# Altium project PCB_Project_BO6.PrjPcb
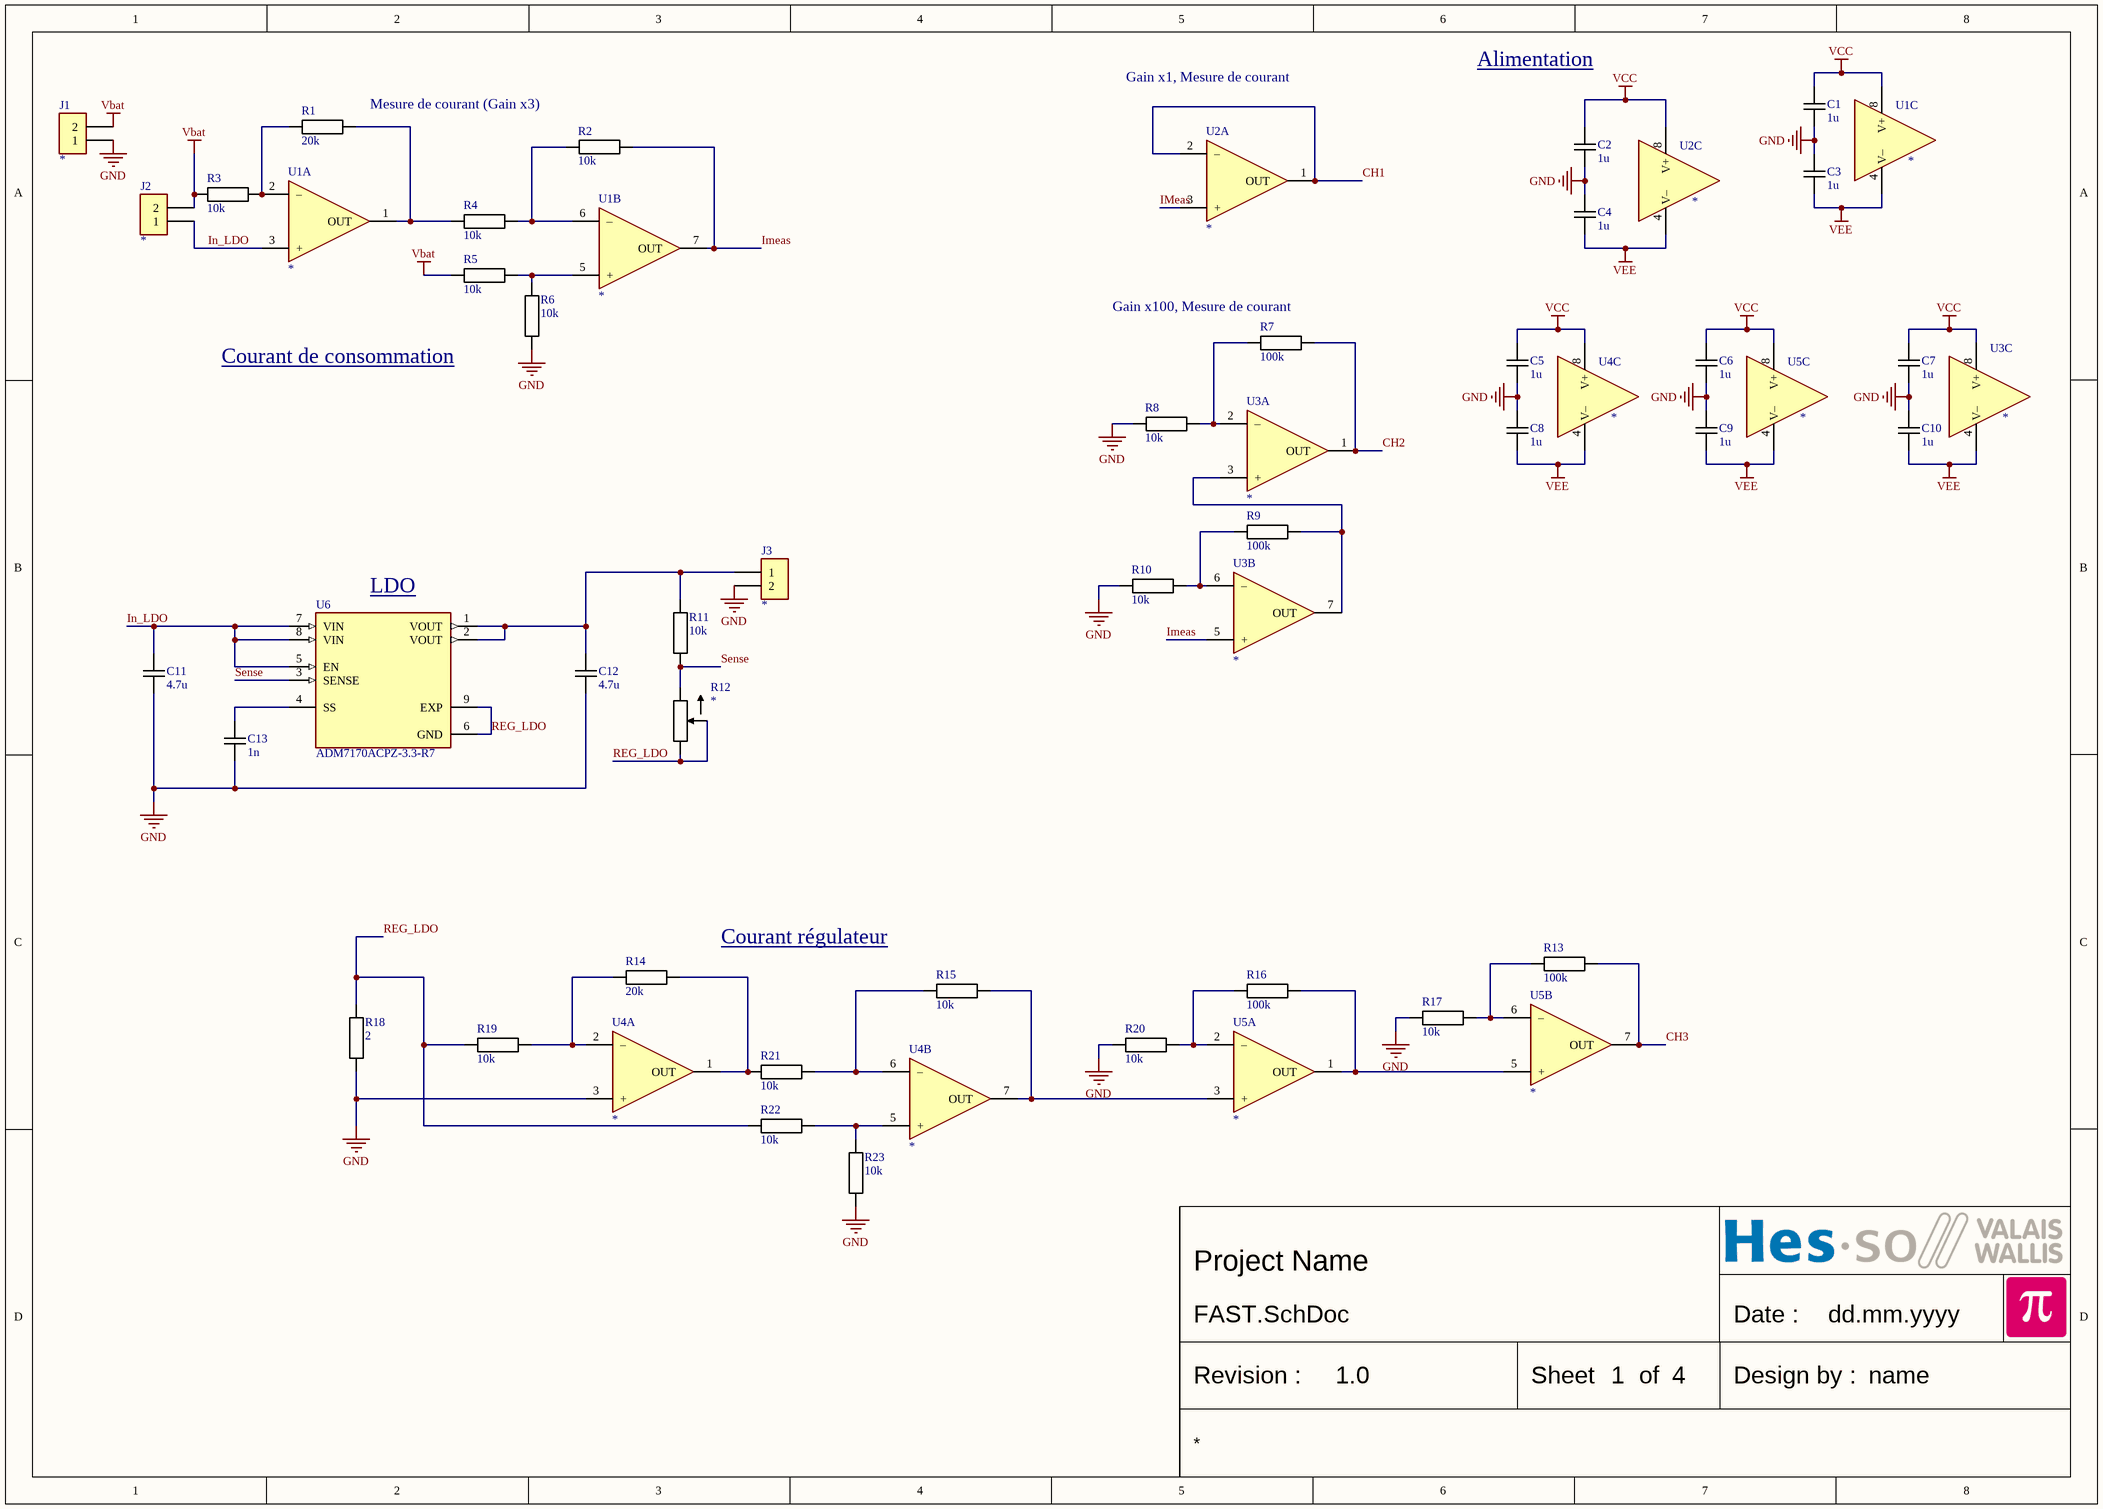
[diagram p0: FAST.SchDoc]
PcbDate: dd.mm.yyyy; PcbDesigner: name; PcbRevision: 1.0; SchematicDate: dd.mm.yyyy; SchematicDesigner: name; SchematicRevision: 1.0
4 sheets, 159 parts. Net scope: global (net labels, ports and power ports of the same name join across sheets).
Board file: Eurocircuits4L.PcbDoc
Sheets:
  FAST.SchDoc
  PROC.SchDoc
  SLOW.SchDoc
  Batterie.SchDoc

## Sheet FAST.SchDoc
size A3; CompanyName: HESSO; Address1: Route du Rawyl 47; Address2: 1950 Sion; Address3: Switzerland; SheetNumber: 1; SheetTotal: 4; PageSetup: Record=PageOptions|CenterHorizontal=True|CenterVertical=True|PrintScale=1.00|XCorrection=1.00|YCorrection=1.00|PrintKind=1|BorderSize=5000000|LeftOffset=0|BottomOffset=0|Orientation=2|PaperLength=1000|PaperWidth=1000|Scale=100|PaperSource=15|PrintQuality=1200|MediaType=1|DitherType=10|PrintScaleMode=1|PaperKind=A4|PaperIndex=9; ProjectName: Project Name

### Parts
C1  1u  [CAPACITOR 1005 REFLOW]
C2  1u  [CAPACITOR 1005 REFLOW]
C3  1u  [CAPACITOR 1005 REFLOW]
C4  1u  [CAPACITOR 1005 REFLOW]
C5  1u  [CAPACITOR 1005 REFLOW]
C6  1u  [CAPACITOR 1005 REFLOW]
C7  1u  [CAPACITOR 1005 REFLOW]
C8  1u  [CAPACITOR 1005 REFLOW]
C9  1u  [CAPACITOR 1005 REFLOW]
C10  1u  [CAPACITOR 1005 REFLOW]
C11  4.7u  [CAPACITOR 1005 REFLOW]
C12  4.7u  [CAPACITOR 1005 REFLOW]
C13  1n  [CAPACITOR 1005 REFLOW]
J1  *  [WE 691312510002]
J2  *  [WE 691312510002]
J3  *  [WE 691312510002]
R1  20k  [RESISTOR 1005 REFLOW]
R2  10k  [RESISTOR 1005 REFLOW]
R3  10k  [RESISTOR 1005 REFLOW]
R4  10k  [RESISTOR 1005 REFLOW]
R5  10k  [RESISTOR 1005 REFLOW]
R6  10k  [RESISTOR 1005 REFLOW]
R7  100k  [RESISTOR 1005 REFLOW]
R8  10k  [RESISTOR 1005 REFLOW]
R9  100k  [RESISTOR 1005 REFLOW]
R10  10k  [RESISTOR 1005 REFLOW]
R11  10k  [RESISTOR 1005 REFLOW]
R12  *  [Trimmer PIHER PT15]
R13  100k  [RESISTOR 1005 REFLOW]
R14  20k  [RESISTOR 1005 REFLOW]
R15  10k  [RESISTOR 1005 REFLOW]
R16  100k  [RESISTOR 1005 REFLOW]
R17  10k  [RESISTOR 1005 REFLOW]
R18  2  [RESISTOR 1005 REFLOW]
R19  10k  [RESISTOR 1005 REFLOW]
R20  10k  [RESISTOR 1005 REFLOW]
R21  10k  [RESISTOR 1005 REFLOW]
R22  10k  [RESISTOR 1005 REFLOW]
R23  10k  [RESISTOR 1005 REFLOW]
U1  *  [SO8 P1.27 C4.0X5.0 H1.75]  (parts A,B,C of 3)
U2  *  [SO8 P1.27 C4.0X5.0 H1.75]  (parts A,C of 3)
U3  *  [SO8 P1.27 C4.0X5.0 H1.75]  (parts A,B,C of 3)
U4  *  [SO8 P1.27 C4.0X5.0 H1.75]  (parts A,B,C of 3)
U5  *  [SO8 P1.27 C4.0X5.0 H1.75]  (parts A,B,C of 3)
U6  ADM7170ACPZ-3.3-R7  [LFCSP8 P0.5 C3.0x2.8 H1.0]

### Nets
GND: C1.2 C2.2 C3.1 C4.1 C5.2 C6.2 C7.2 C8.1 C9.1 C10.1 C11.2 C12.2 C13.2 J1.1 J3.2 R6.1 R8.1 R10.1 R17.2 R18.1 R20.2 R23.2 U4.3(+)
Vbat: J1.2 J2.2 R3.1 R5.1
VCC: C1.1 C2.1 C5.1 C6.1 C7.1 U1.8(V+) U2.8(V+) U3.8(V+) U4.8(V+) U5.8(V+)
VEE: C3.2 C4.2 C8.2 C9.2 C10.2 U1.4(V–) U2.4(V–) U3.4(V–) U4.4(V–) U5.4(V–)
CH1: U2.1(OUT) U2.2(–)
CH2: R7.2 U3.1(OUT)
CH3: R13.1 U5.7(OUT)
IMeas: R2.2 U1.7(OUT) U2.3(+) U3.5(+)
In_LDO: C11.1 J2.1 U1.3(+) U6.5(EN) U6.7(VIN) U6.8(VIN)
REG_LDO: R12.1 R12.2(WIPER) R18.2 R19.2 R22.2 U6.6(GND) U6.9(EXP)
Sense: R11.1 R12.3 U6.3(SENSE)
NetC12_1: C12.1 J3.1 R11.2 U6.1(VOUT) U6.2(VOUT)
NetC13_1: C13.1 U6.4(SS)
NetR1_1: R1.1 R3.2 U1.2(–)
NetR1_2: R1.2 R4.1 U1.1(OUT)
NetR2_1: R2.1 R4.2 U1.6(–)
NetR5_2: R5.2 R6.2 U1.5(+)
NetR7_1: R7.1 R8.2 U3.2(–)
NetR9_1: R9.1 R10.2 U3.6(–)
NetR9_2: R9.2 U3.3(+) U3.7(OUT)
NetR13_2: R13.2 R17.1 U5.6(–)
NetR14_1: R14.1 R21.2 U4.1(OUT)
NetR14_2: R14.2 R19.1 U4.2(–)
NetR15_1: R15.1 U4.7(OUT) U5.3(+)
NetR15_2: R15.2 R21.1 U4.6(–)
NetR16_1: R16.1 U5.1(OUT) U5.5(+)
NetR16_2: R16.2 R20.1 U5.2(–)
NetR22_1: R22.1 R23.1 U4.5(+)

### Notes on the sheet
- Mesure de courant (Gain x3)
- Gain x1, Mesure de courant
- Alimentation
- (near R7) Gain x100, Mesure de courant
- Courant de consommation
- (near U6) LDO
- Courant régulateur
- Date :
- Revision :
- Sheet
- of
- Design by :

### Library data of the parts
C1-C13 = Capacitor
  C1-C10: Value: 1u
  C11 C12: Value: 4.7u
  C13: Value: 1n
J1-J3 = Header2: PCB terminal block; Value: *
R1-R11 R13-R23 = Resistor
  R1 R14: Value: 20k
  R2-R6 R8 R10 R11 R15 R17 R19-R23: Value: 10k
  R7 R9 R13 R16: Value: 100k
  R18: Value: 2
R12 = Trimmer: Value: *
U1-U5 = OPA DUAL: Generic dual OPA 8 pins; Value: *
U6 = ADM7170ACPZ-3.3-R7: 6.5 V, 500 mA, Ultralow Noise, High PSRR, Fast Transient Response CMOS LDO; MF: Analog Devices; SnapEDA_Link: https://www.snapeda.com/parts/ADM7170ACPZ-3.3-R7/Analog+Devices/view-part/?ref=snap; Package: LFCSP -8 Analog Devices; Value: *; MP: ADM7170ACPZ-3.3-R7; Check_prices: https://www.snapeda.com/parts/ADM7170ACPZ-3.3-R7/Analog+Devices/view-part/?ref=eda

## Sheet PROC.SchDoc
size A3; CompanyName: HESSO; Address1: Route du Rawyl 47; Address2: 1950 Sion; Address3: Switzerland; SheetNumber: 2; SheetTotal: 4; PageSetup: Record=PageOptions|CenterHorizontal=True|CenterVertical=True|PrintScale=1.00|XCorrection=1.00|YCorrection=1.00|PrintKind=1|BorderSize=5000000|LeftOffset=0|BottomOffset=0|Orientation=2|PaperLength=1000|PaperWidth=1000|Scale=100|PaperSource=15|PrintQuality=1200|MediaType=1|DitherType=10|PrintScaleMode=1|PaperKind=A4|PaperIndex=9; ProjectName: Project Name
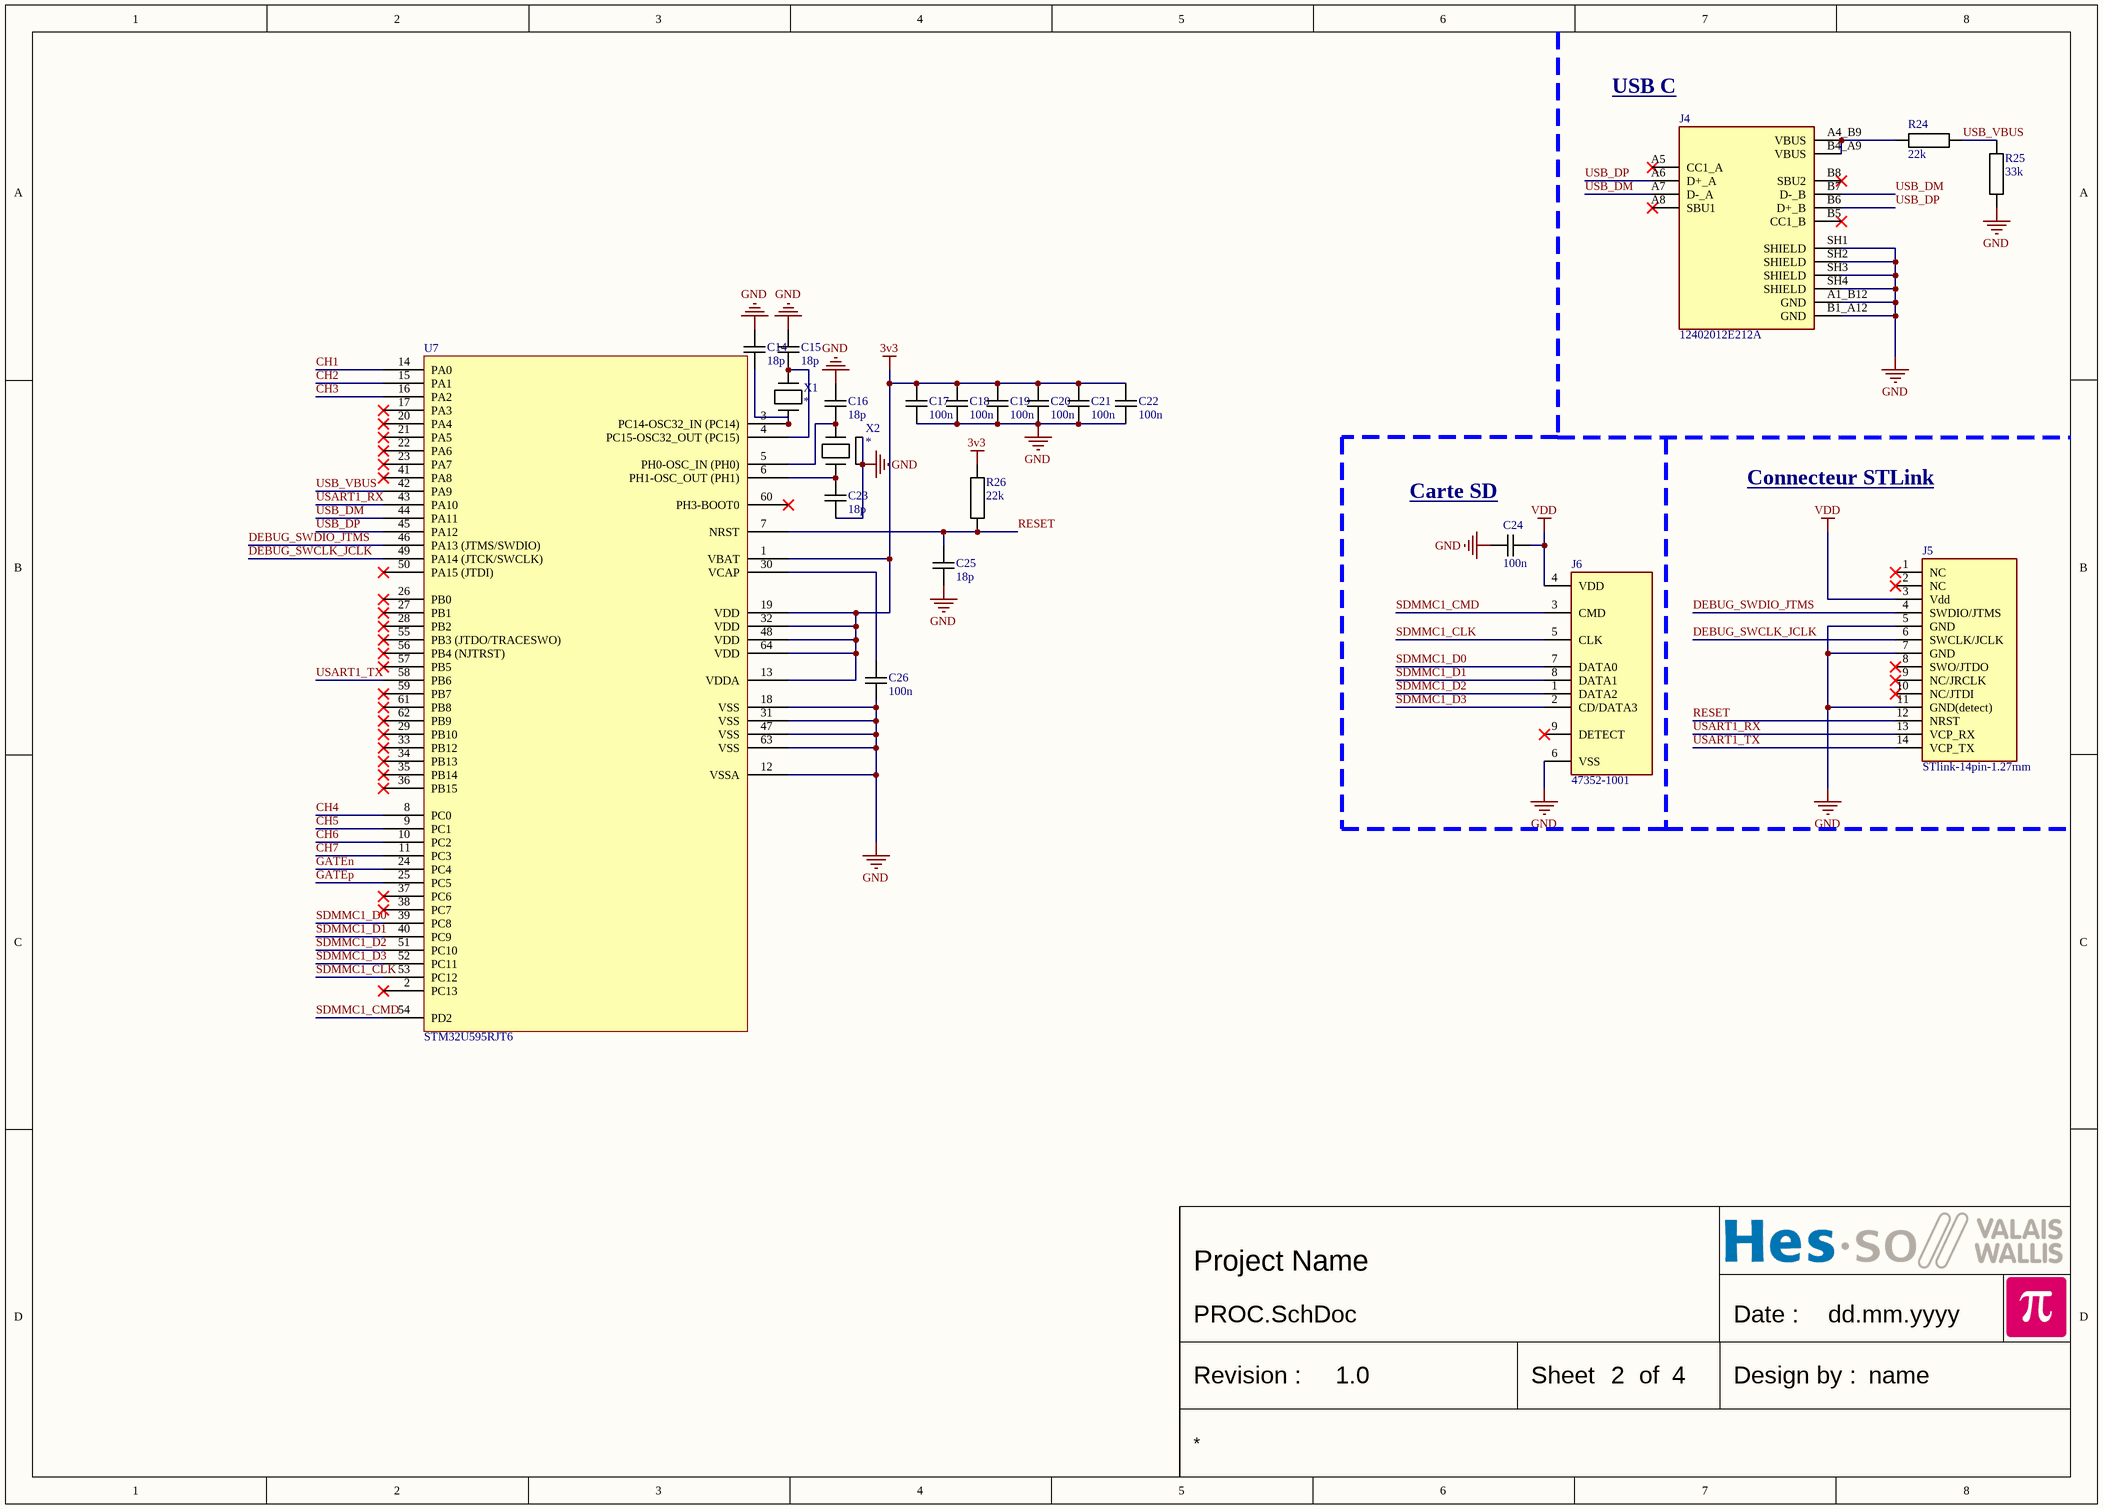
[diagram p1: PROC.SchDoc]

### Parts
C14  18p  [CAPACITOR 1005 REFLOW]
C15  18p  [CAPACITOR 1005 REFLOW]
C16  18p  [CAPACITOR 1005 REFLOW]
C17  100n  [CAPACITOR 1005 REFLOW]
C18  100n  [CAPACITOR 1005 REFLOW]
C19  100n  [CAPACITOR 1005 REFLOW]
C20  100n  [CAPACITOR 1005 REFLOW]
C21  100n  [CAPACITOR 1005 REFLOW]
C22  100n  [CAPACITOR 1005 REFLOW]
C23  18p  [CAPACITOR 1005 REFLOW]
C24  100n  [CAPACITOR 1005 REFLOW]
C25  18p  [CAPACITOR 1005 REFLOW]
C26  100n  [CAPACITOR 1005 REFLOW]
J4  12402012E212A  [USB-C-SMD Amphenol 12402012E212A]
J5  STlink-14pin-1.27mm  [FTSH-107-01-S-D-K]
J6  47352-1001  [SD MICRO MOLEX 47352-1001]
R24  22k  [RESISTOR 1005 REFLOW]
R25  33k  [RESISTOR 1005 REFLOW]
R26  22k  [RESISTOR 1005 REFLOW]
U7  STM32U595RJT6  [TSQFP50P1200X1200X160-64N]
X1  *  [Crystal C3.2x1.5 Abracon ABS07]
X2  *  [Crystal C2.0x1.6 Kyocera CX2016DB]

### Nets
3v3: C17.1 C18.1 C19.1 C20.1 C21.1 C22.1 R26.2 U7.1(VBAT) U7.13(VDDA) U7.19(VDD) U7.32(VDD) U7.48(VDD) U7.64(VDD)
GND: C14.1 C15.1 C16.1 C17.2 C18.2 C19.2 C20.2 C21.2 C22.2 C23.2 C24.2 C25.2 C26.2 J4.A1_B12(GND) J4.B1_A12(GND) J4.SH1(SHIELD) J4.SH2(SHIELD) J4.SH3(SHIELD) J4.SH4(SHIELD) J5.5(GND) J5.7(GND) J5.11(GND(detect)) J6.6(VSS) R25.1 U7.12(VSSA) U7.18(VSS) U7.31(VSS) U7.47(VSS) U7.63(VSS) X2.2 X2.4
VDD: C24.1 J5.3(Vdd) J6.4(VDD)
CH1: U7.14(PA0)
CH2: U7.15(PA1)
CH3: U7.16(PA2)
CH4: U7.8(PC0)
CH5: U7.9(PC1)
CH6: U7.10(PC2)
CH7: U7.11(PC3)
DEBUG_SWCLK_JCLK: J5.6(SWCLK/JCLK) U7.49(PA14_(JTCK/SWCLK))
DEBUG_SWDIO_JTMS: J5.4(SWDIO/JTMS) U7.46(PA13_(JTMS/SWDIO))
GATEn: U7.24(PC4)
GATEp: U7.25(PC5)
RESET: C25.1 J5.12(NRST) R26.1 U7.7(NRST)
SDMMC1_CLK: J6.5(CLK) U7.53(PC12)
SDMMC1_CMD: J6.3(CMD) U7.54(PD2)
SDMMC1_D0: J6.7(DATA0) U7.39(PC8)
SDMMC1_D1: J6.8(DATA1) U7.40(PC9)
SDMMC1_D2: J6.1(DATA2) U7.51(PC10)
SDMMC1_D3: J6.2(CD/DATA3) U7.52(PC11)
USART1_RX: J5.13(VCP_RX) U7.43(PA10)
USART1_TX: J5.14(VCP_TX) U7.58(PB6)
USB_DM: J4.A7(D-_A) J4.B7(D-_B) U7.44(PA11)
USB_DP: J4.A6(D+_A) J4.B6(D+_B) U7.45(PA12)
USB_VBUS: R24.2 R25.2 U7.42(PA9)
NetC14_2: C14.2 U7.3(PC14-OSC32_IN_(PC14)) X1.1
NetC15_2: C15.2 U7.4(PC15-OSC32_OUT_(PC15)) X1.2
NetC16_2: C16.2 U7.5(PH0-OSC_IN_(PH0)) X2.3
NetC23_1: C23.1 U7.6(PH1-OSC_OUT_(PH1)) X2.1
NetC26_1: C26.1 U7.30(VCAP)
NetJ4_A4_B9: J4.A4_B9(VBUS) J4.B4_A9(VBUS) R24.1

Not connected (* = marked no-connect by the designer): J4 A5(CC1_A)* A8(SBU1)* B5(CC1_B)* B8(SBU2)*; J5 1(NC)* 2(NC)* 8(SWO/JTDO)* 9(NC/JRCLK)* 10(NC/JTDI)*; J6 9(DETECT)*; U7 2(PC13)* 17(PA3)* 20(PA4)* 21(PA5)* 22(PA6)* 23(PA7)* 26(PB0)* 27(PB1)* 28(PB2)* 29(PB10)* 33(PB12)* 34(PB13)* 35(PB14)* 36(PB15)* 37(PC6)* 38(PC7)* 41(PA8)* 50(PA15_(JTDI))* 55(PB3_(JTDO/TRACESWO))* 56(PB4_(NJTRST))* 57(PB5)* 59(PB7)* 60(PH3-BOOT0)* 61(PB8)* 62(PB9)*

### Notes on the sheet
- (near J4) USB C
- (near C24) Carte SD
- Connecteur STLink
- Date :
- Revision :
- Sheet
- of
- Design by :

### Library data of the parts
C14-C26 = Capacitor
  C14-C16 C23 C25: Value: 18p
  C17-C22 C24 C26: Value: 100n
J4 = USB-C-SMD Amphenol 12402012E212A: Value: 12402012E212A
J6 = SD-MICRO MOLEX 47352-1001: SD Card  Micro; Value: 47352-1001
R24-R26 = Resistor
  R24 R26: Value: 22k
  R25: Value: 33k
X1 = Crystal C3.2x1.5 Abracon ABS07: Value: *
X2 = Crystal C2.0x1.6 Kyocera CX2016DB: Value: *
J5 = STlink-14pin-1.27mm: Value: STlink-14pin-1.27mm

## Sheet SLOW.SchDoc
size A3; CompanyName: HESSO; Address1: Route du Rawyl 47; Address2: 1950 Sion; Address3: Switzerland; SheetNumber: 3; SheetTotal: 4; PageSetup: Record=PageOptions|CenterHorizontal=True|CenterVertical=True|PrintScale=1.00|XCorrection=1.00|YCorrection=1.00|PrintKind=1|BorderSize=5000000|LeftOffset=0|BottomOffset=0|Orientation=2|PaperLength=1000|PaperWidth=1000|Scale=100|PaperSource=15|PrintQuality=1200|MediaType=1|DitherType=10|PrintScaleMode=1|PaperKind=A4|PaperIndex=9; ProjectName: Project Name
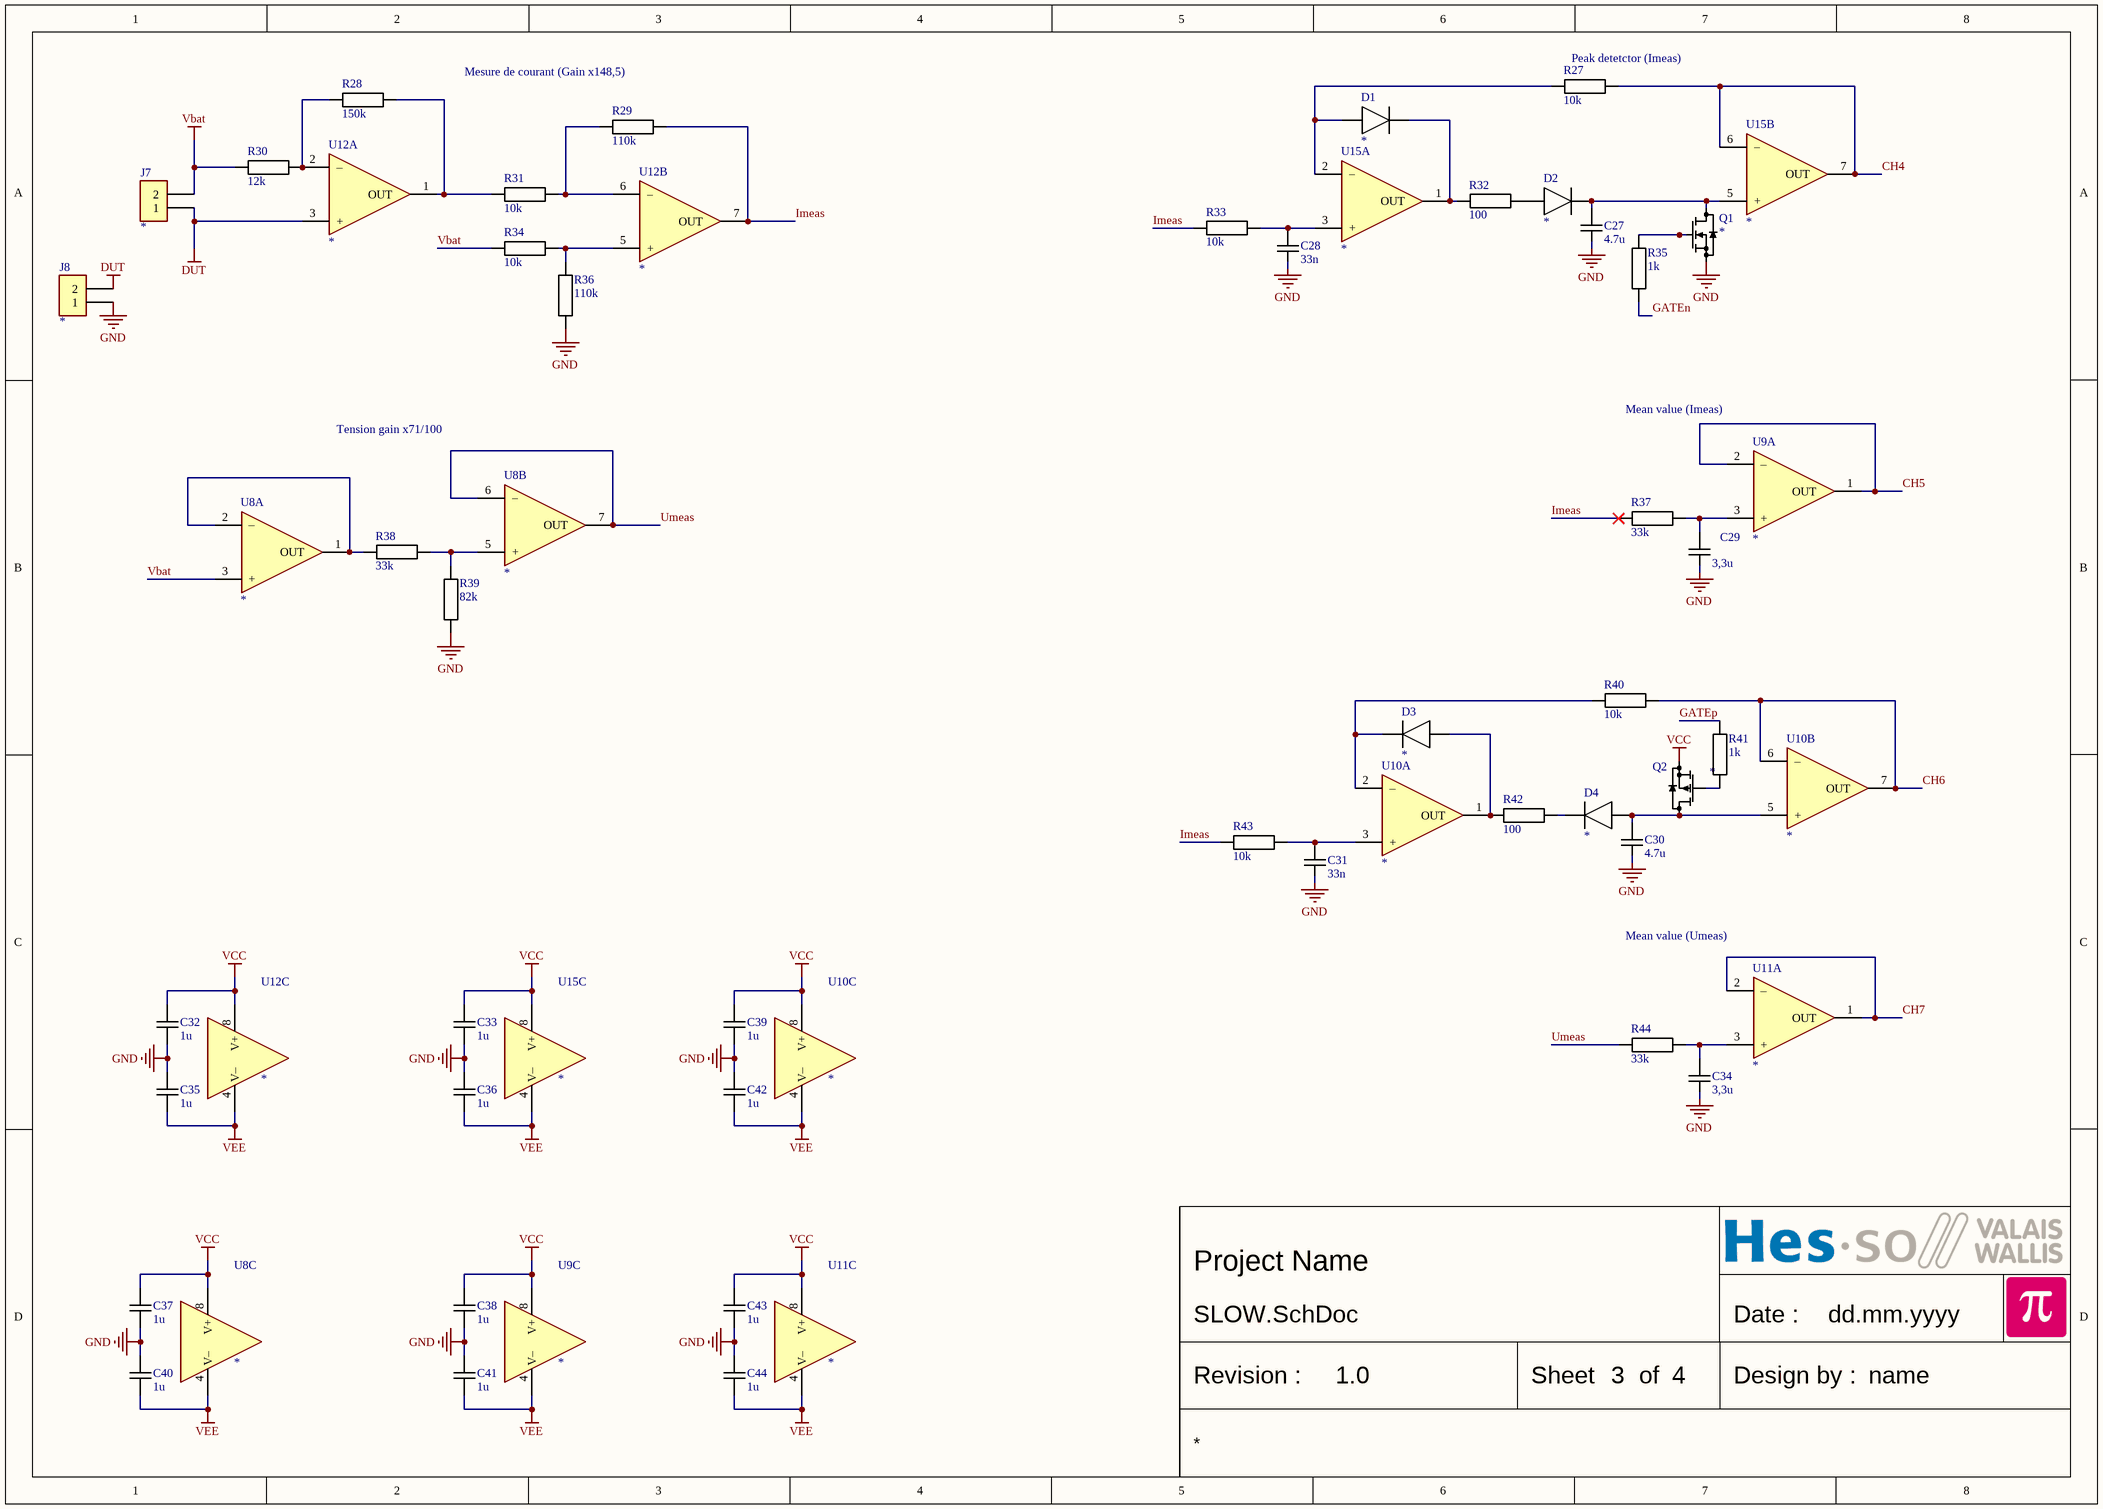
[diagram p2: SLOW.SchDoc]

### Parts
C27  4.7u  [CAPACITOR 1005 REFLOW]
C28  33n  [CAPACITOR 1005 REFLOW]
C29  3,3u  [CAPACITOR 1005 REFLOW]
C30  4.7u  [CAPACITOR 1005 REFLOW]
C31  33n  [CAPACITOR 1005 REFLOW]
C32  1u  [CAPACITOR 1005 REFLOW]
C33  1u  [CAPACITOR 1005 REFLOW]
C34  3,3u  [CAPACITOR 1005 REFLOW]
C35  1u  [CAPACITOR 1005 REFLOW]
C36  1u  [CAPACITOR 1005 REFLOW]
C37  1u  [CAPACITOR 1005 REFLOW]
C38  1u  [CAPACITOR 1005 REFLOW]
C39  1u  [CAPACITOR 1005 REFLOW]
C40  1u  [CAPACITOR 1005 REFLOW]
C41  1u  [CAPACITOR 1005 REFLOW]
C42  1u  [CAPACITOR 1005 REFLOW]
C43  1u  [CAPACITOR 1005 REFLOW]
C44  1u  [CAPACITOR 1005 REFLOW]
D1  *  [DIODE SOD323 REFLOW]
D2  *  [DIODE SOD323 REFLOW]
D3  *  [DIODE SOD323 REFLOW]
D4  *  [DIODE SOD323 REFLOW]
J7  *  [WE 691312510002]
J8  *  [WE 691312510002]
Q1  *  [SOT23 P0.95 C1.6x3.0 H1.3]
Q2  *  [SOT23 P0.95 C1.6x3.0 H1.3]
R27  10k  [RESISTOR 1005 REFLOW]
R28  150k  [RESISTOR 1005 REFLOW]
R29  110k  [RESISTOR 1005 REFLOW]
R30  12k  [RESISTOR 1005 REFLOW]
R31  10k  [RESISTOR 1005 REFLOW]
R32  100  [RESISTOR 1005 REFLOW]
R33  10k  [RESISTOR 1005 REFLOW]
R34  10k  [RESISTOR 1005 REFLOW]
R35  1k  [RESISTOR 1005 REFLOW]
R36  110k  [RESISTOR 1005 REFLOW]
R37  33k  [RESISTOR 1005 REFLOW]
R38  33k  [RESISTOR 1005 REFLOW]
R39  82k  [RESISTOR 1005 REFLOW]
R40  10k  [RESISTOR 1005 REFLOW]
R41  1k  [RESISTOR 1005 REFLOW]
R42  100  [RESISTOR 1005 REFLOW]
R43  10k  [RESISTOR 1005 REFLOW]
R44  33k  [RESISTOR 1005 REFLOW]
U8  *  [SO8 P1.27 C4.0X5.0 H1.75]  (parts A,B,C of 3)
U9  *  [SO8 P1.27 C4.0X5.0 H1.75]  (parts A,C of 3)
U10  *  [SO8 P1.27 C4.0X5.0 H1.75]  (parts A,B,C of 3)
U11  *  [SO8 P1.27 C4.0X5.0 H1.75]  (parts A,C of 3)
U12  *  [SO8 P1.27 C4.0X5.0 H1.75]  (parts A,B,C of 3)
U15  *  [SO8 P1.27 C4.0X5.0 H1.75]  (parts A,B,C of 3)

### Nets
DUT: J7.1 J8.2 U12.3(+)
GND: C27.2 C28.2 C29.2 C30.2 C31.2 C32.2 C33.2 C34.2 C35.1 C36.1 C37.2 C38.2 C39.2 C40.1 C41.1 C42.1 C43.2 C44.1 J8.1 Q1.2(S) R36.1 R39.1
Vbat: J7.2 R30.1 R34.1 U8.3(+)
VCC: C32.1 C33.1 C37.1 C38.1 C39.1 C43.1 Q2.2(S) U8.8(V+) U9.8(V+) U10.8(V+) U11.8(V+) U12.8(V+) U15.8(V+)
VEE: C35.2 C36.2 C40.2 C41.2 C42.2 C44.2 U8.4(V–) U9.4(V–) U10.4(V–) U11.4(V–) U12.4(V–) U15.4(V–)
CH4: R27.1 U15.6(–) U15.7(OUT)
CH5: U9.1(OUT) U9.2(–)
CH6: R40.1 U10.6(–) U10.7(OUT)
CH7: U11.1(OUT) U11.2(–)
GATEn: R35.2
GATEp: R41.1
IMeas: R29.2 R33.2 R37.2 R43.2 U12.7(OUT)
Umeas: R44.2 U8.6(–) U8.7(OUT)
NetC27_1: C27.1 D2.1(C) Q1.3(D) U15.5(+)
NetC28_1: C28.1 R33.1 U15.3(+)
NetC29_1: C29.1 R37.1 U9.3(+)
NetC30_1: C30.1 D4.2(A) Q2.3(D) U10.5(+)
NetC31_1: C31.1 R43.1 U10.3(+)
NetC34_1: C34.1 R44.1 U11.3(+)
NetD1_1: D1.1(C) R32.2 U15.1(OUT)
NetD1_2: D1.2(A) R27.2 U15.2(–)
NetD2_2: D2.2(A) R32.1
NetD3_1: D3.1(C) R40.2 U10.2(–)
NetD3_2: D3.2(A) R42.2 U10.1(OUT)
NetD4_1: D4.1(C) R42.1
NetQ1_1: Q1.1(G) R35.1
NetQ2_1: Q2.1(G) R41.2
NetR28_1: R28.1 R30.2 U12.2(–)
NetR28_2: R28.2 R31.1 U12.1(OUT)
NetR29_1: R29.1 R31.2 U12.6(–)
NetR34_2: R34.2 R36.2 U12.5(+)
NetR38_1: R38.1 U8.1(OUT) U8.2(–)
NetR38_2: R38.2 R39.2 U8.5(+)

### Notes on the sheet
- (near R29) Mesure de courant (Gain x148,5)
- (near R27) Peak detetctor (Imeas)
- Tension gain x71/100
- (near U9) Mean value (Imeas)
- (near U11) Mean value (Umeas)
- Date :
- Revision :
- Sheet
- of
- Design by :

### Library data of the parts
C27-C44 = Capacitor
  C27 C30: Value: 4.7u
  C28 C31: Value: 33n
  C29 C34: Value: 3,3u
  C32 C33 C35-C44: Value: 1u
D1-D4 = DIODE: Diode generic 2 leads; Value: *
J7 J8 = Header2: PCB terminal block; Value: *
Q1 = MOS-N SOT23 S-D-G: Generic MOS-N; pin to pad: 1>3 2>1 3>2; Value: *
Q2 = MOS-P SOT23 G-S-D: Generic MOS-P; Value: *
R27-R44 = Resistor
  R27 R31 R33 R34 R40 R43: Value: 10k
  R28: Value: 150k
  R29 R36: Value: 110k
  R30: Value: 12k
  R32 R42: Value: 100
  R35 R41: Value: 1k
  R37 R38 R44: Value: 33k
  R39: Value: 82k
U8-U12 U15 = OPA DUAL: Generic dual OPA 8 pins; Value: *

## Sheet Batterie.SchDoc
size A4; SheetNumber: 4; SheetTotal: 4
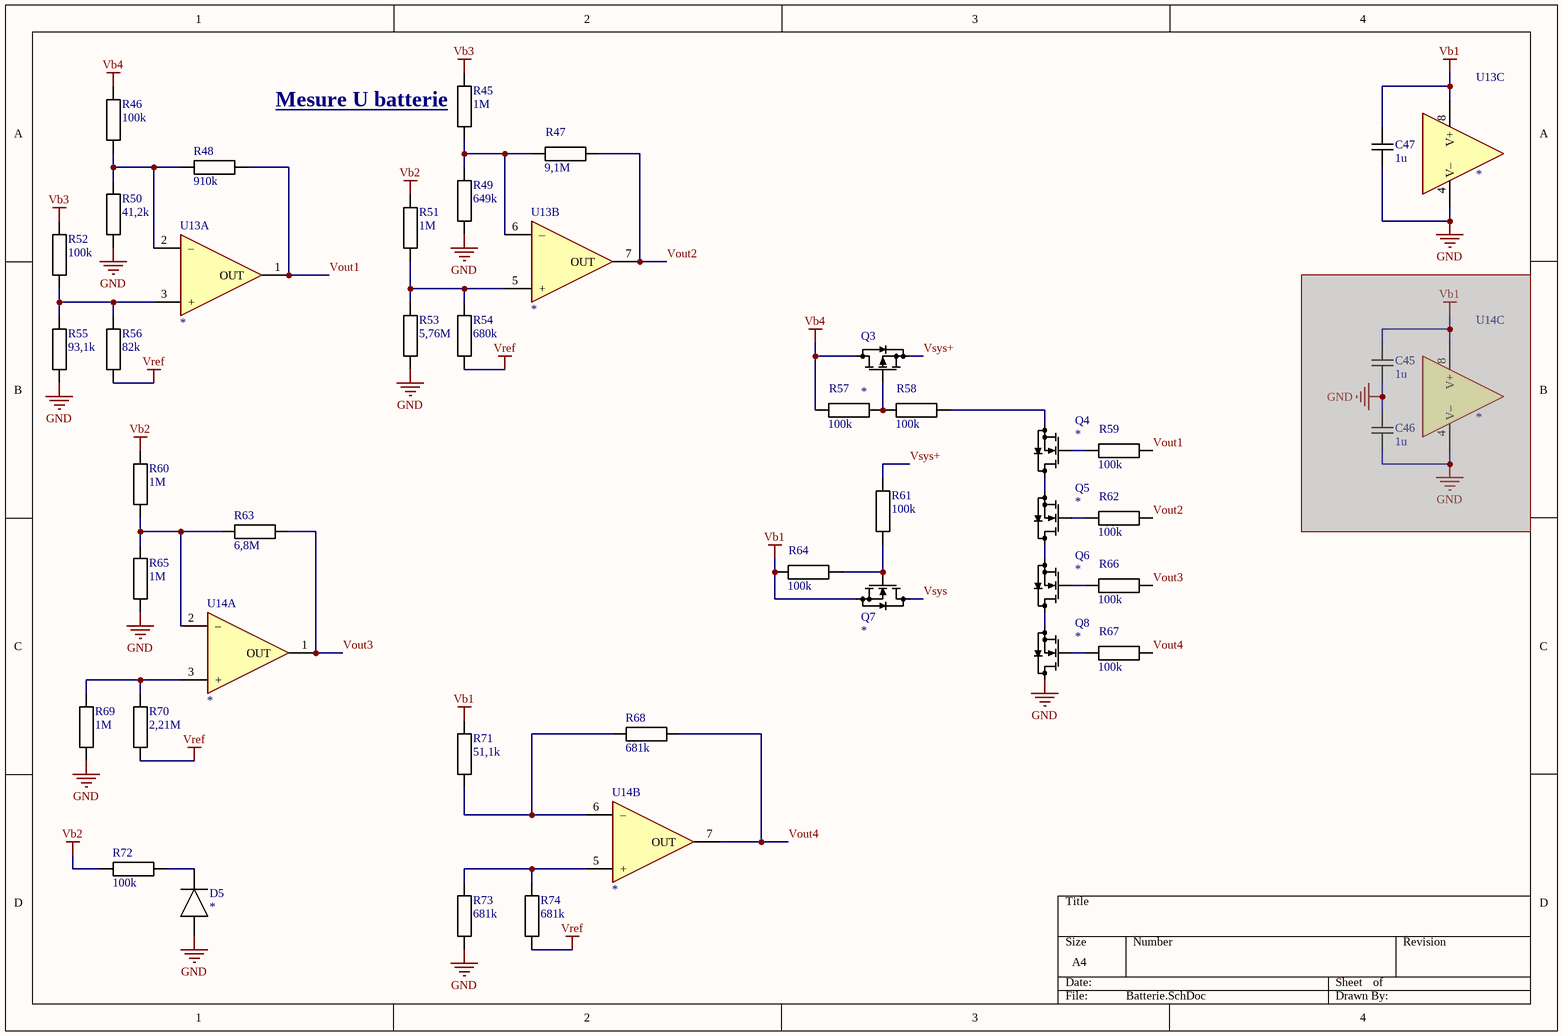
[diagram p3: Batterie.SchDoc]

### Parts
C45  1u  [CAPACITOR 1005 REFLOW]  (masked out: inside a compile mask, not in the netlist)
C46  1u  [CAPACITOR 1005 REFLOW]  (masked out: inside a compile mask, not in the netlist)
C47  1u  [CAPACITOR 1005 REFLOW]
D5  *  [DIODE SOD323 REFLOW]
Q3  *  [SOT23 P0.95 C1.6x3.0 H1.3]
Q4  *  [SOT23 P0.95 C1.6x3.0 H1.3]
Q5  *  [SOT23 P0.95 C1.6x3.0 H1.3]
Q6  *  [SOT23 P0.95 C1.6x3.0 H1.3]
Q7  *  [SOT23 P0.95 C1.6x3.0 H1.3]
Q8  *  [SOT23 P0.95 C1.6x3.0 H1.3]
R45  1M  [RESISTOR 1005 REFLOW]
R46  100k  [RESISTOR 1005 REFLOW]
R47  9,1M  [RESISTOR 1005 REFLOW]
R48  910k  [RESISTOR 1005 REFLOW]
R49  649k  [RESISTOR 1005 REFLOW]
R50  41,2k  [RESISTOR 1005 REFLOW]
R51  1M  [RESISTOR 1005 REFLOW]
R52  100k  [RESISTOR 1005 REFLOW]
R53  5,76M  [RESISTOR 1005 REFLOW]
R54  680k  [RESISTOR 1005 REFLOW]
R55  93,1k  [RESISTOR 1005 REFLOW]
R56  82k  [RESISTOR 1005 REFLOW]
R57  100k  [RESISTOR 1005 REFLOW]
R58  100k  [RESISTOR 1005 REFLOW]
R59  100k  [RESISTOR 1005 REFLOW]
R60  1M  [RESISTOR 1005 REFLOW]
R61  100k  [RESISTOR 1005 REFLOW]
R62  100k  [RESISTOR 1005 REFLOW]
R63  6,8M  [RESISTOR 1005 REFLOW]
R64  100k  [RESISTOR 1005 REFLOW]
R65  1M  [RESISTOR 1005 REFLOW]
R66  100k  [RESISTOR 1005 REFLOW]
R67  100k  [RESISTOR 1005 REFLOW]
R68  681k  [RESISTOR 1005 REFLOW]
R69  1M  [RESISTOR 1005 REFLOW]
R70  2,21M  [RESISTOR 1005 REFLOW]
R71  51,1k  [RESISTOR 1005 REFLOW]
R72  100k  [RESISTOR 1005 REFLOW]
R73  681k  [RESISTOR 1005 REFLOW]
R74  681k  [RESISTOR 1005 REFLOW]
U13  *  [SO8 P1.27 C4.0X5.0 H1.75]  (parts A,B,C of 3)
U14  *  [SO8 P1.27 C4.0X5.0 H1.75]  (parts A,B,C of 3)

### Nets
GND: C47.2 D5.2(A) Q8.3(D) R49.1 R50.1 R53.1 R55.1 R65.1 R69.1 R73.1 U13.4(V–)
Vb1: C47.1 Q7.2(S) R64.2 R71.2 U13.8(V+)
Vb2: R51.2 R60.2 R72.2
Vb3: R45.2 R52.2
Vb4: Q3.3(D) R46.2 R57.2
Vref: R54.1 R56.1 R70.1 R74.1
Vout1: R48.1 R59.1 U13.1(OUT)
Vout2: R47.1 R62.1 U13.7(OUT)
Vout3: R63.1 R66.1 U14.1(OUT)
Vout4: R67.1 R68.1 U14.7(OUT)
Vsys: Q7.3(D)
Vsys+: Q3.2(S) R61.2
NetD5_1: D5.1(C) R72.1
NetQ3_1: Q3.1(G) R57.1 R58.2
NetQ4_1: Q4.1(G) R59.2
NetQ4_2: Q4.2(S) R58.1
NetQ4_3: Q4.3(D) Q5.2(S)
NetQ5_1: Q5.1(G) R62.2
NetQ5_3: Q5.3(D) Q6.2(S)
NetQ6_1: Q6.1(G) R66.2
NetQ6_3: Q6.3(D) Q8.2(S)
NetQ7_1: Q7.1(G) R61.1 R64.1
NetQ8_1: Q8.1(G) R67.2
NetR45_1: R45.1 R47.2 R49.2 U13.6(–)
NetR46_1: R46.1 R48.2 R50.2 U13.2(–)
NetR51_1: R51.1 R53.2 R54.2 U13.5(+)
NetR52_1: R52.1 R55.2 R56.2 U13.3(+)
NetR60_1: R60.1 R63.2 R65.2 U14.2(–)
NetR68_2: R68.2 R71.1 U14.6(–)
NetR69_2: R69.2 R70.2 U14.3(+)
NetR73_2: R73.2 R74.2 U14.5(+)

### Notes on the sheet
- (near R45) Mesure U batterie

### Library data of the parts
C45-C47 = Capacitor: Value: 1u
D5 = DIODE: Diode generic 2 leads; Value: *
Q3 = MOS-P SOT23 G-S-D: Generic MOS-P; Value: *
Q4-Q8 = MOS-N SOT23 S-D-G: Generic MOS-N; pin to pad: 1>3 2>1 3>2; Value: *
R45-R74 = Resistor
  R45 R51 R60 R65 R69: Value: 1M
  R46 R52 R57-R59 R61 R62 R64 R66 R67 R72: Value: 100k
  R47: Value: 9,1M
  R48: Value: 910k
  R49: Value: 649k
  R50: Value: 41,2k
  R53: Value: 5,76M
  R54: Value: 680k
  R55: Value: 93,1k
  R56: Value: 82k
  R63: Value: 6,8M
  R68 R73 R74: Value: 681k
  R70: Value: 2,21M
  R71: Value: 51,1k
U13 U14 = OPA DUAL: Generic dual OPA 8 pins; Value: *

## Nets that join several sheets
GND: FAST (23 pins), PROC (31 pins), SLOW (22 pins), Batterie (11 pins)
Vbat: FAST (J1.2 J2.2 R3.1 R5.1), SLOW (J7.2 R30.1 R34.1 U8.3)
VCC: FAST (10 pins), SLOW (13 pins)
VEE: FAST (10 pins), SLOW (12 pins)
CH1: FAST (U2.1 U2.2), PROC (U7.14)
CH2: FAST (R7.2 U3.1), PROC (U7.15)
CH3: FAST (R13.1 U5.7), PROC (U7.16)
CH4: PROC (U7.8), SLOW (R27.1 U15.6 U15.7)
CH5: PROC (U7.9), SLOW (U9.1 U9.2)
CH6: PROC (U7.10), SLOW (R40.1 U10.6 U10.7)
CH7: PROC (U7.11), SLOW (U11.1 U11.2)
GATEn: PROC (U7.24), SLOW (R35.2)
GATEp: PROC (U7.25), SLOW (R41.1)
IMeas: FAST (R2.2 U1.7 U2.3 U3.5), SLOW (5 pins)